# EAGLE design wf121_breakout_v20 (EAGLE 7.5.0)
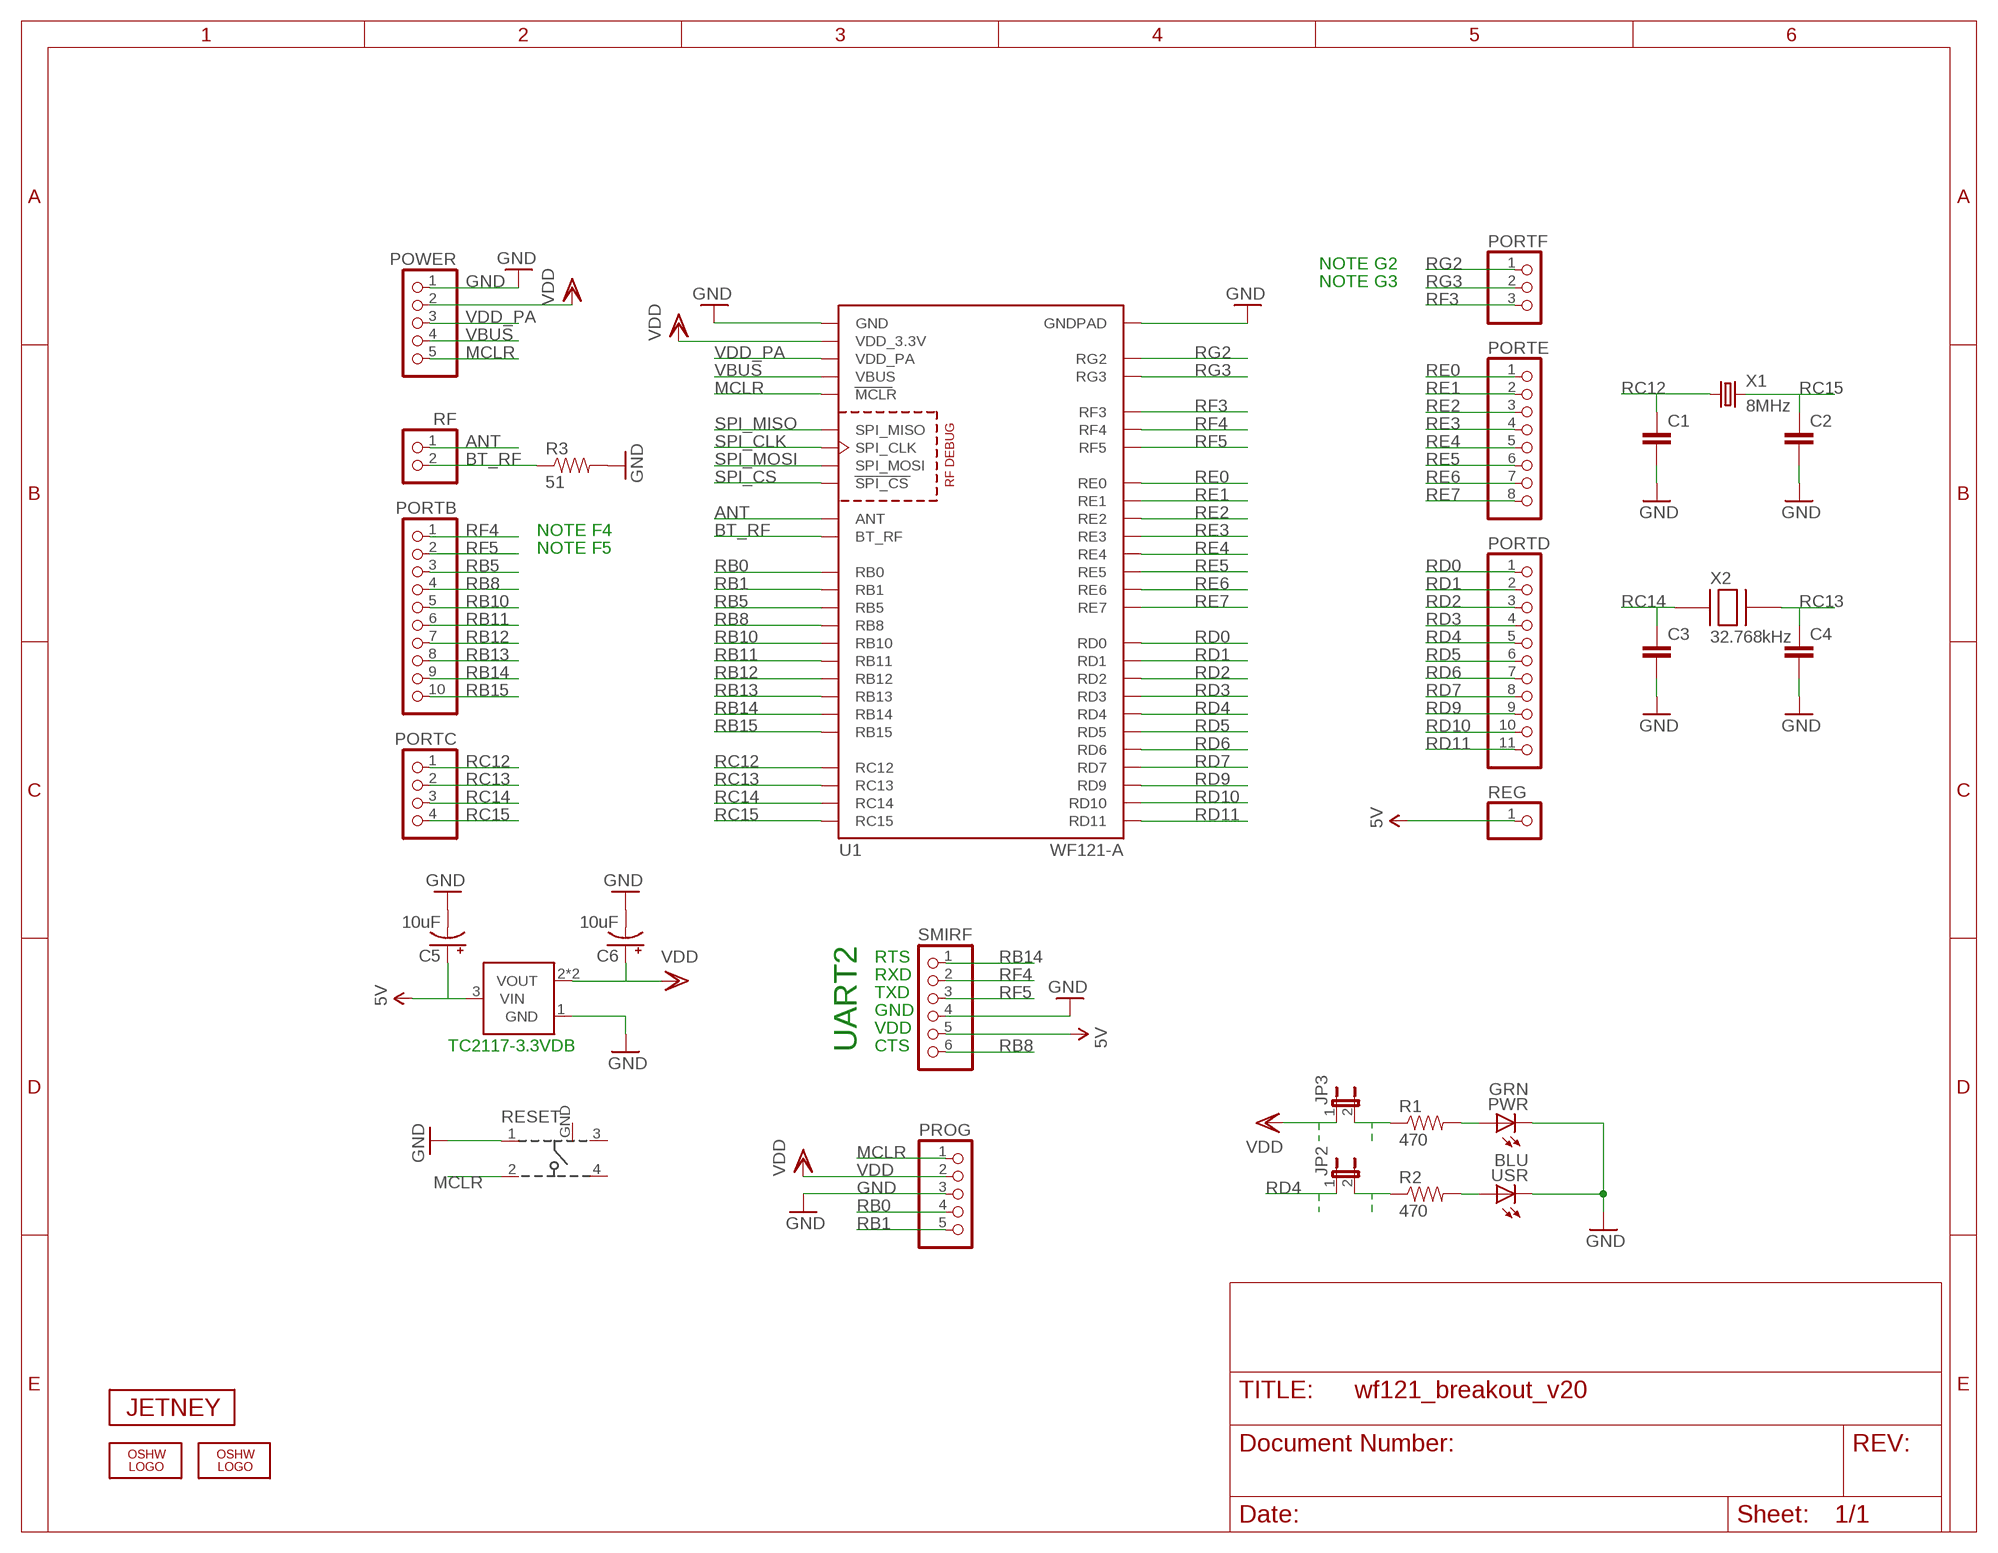
[diagram p0: schematic, sheet 1]

## Parts
C1  CAP0603-CAP  [0603-CAP]
C2  CAP0603-CAP  [0603-CAP]
C3  CAP0603-CAP  [0603-CAP]
C4  CAP0603-CAP  [0603-CAP]
C5  10uF  CAP_POL1206  [EIA3216]
C6  10uF  CAP_POL1206  [EIA3216]
JP2  JUMPER-2SMD-NC  [SJ_2S]
JP3  JUMPER-2SMD-NC  [SJ_2S]
LOGO1  OSHW_LOGO_FILLX0100-NT  [OSHW_FILLX100_NOTEXT]
LOGO2  OSHW_LOGO_FILLX0100-NT  [OSHW_FILLX100_NOTEXT]
PORTB  PINHD-1X10  [1X10]
PORTC  PINHD-1X4  [1X04]
PORTD  PINHD-1X11  [1X11]
PORTE  PINHD-1X8  [1X08]
PORTF  PINHD-1X3  [1X03]
POWER  PINHD-1X5  [1X05]
PROG  PINHD-1X5  [1X05]
PWR  GRN  LEDCHIPLED_0805  [CHIPLED_0805]
R1  470  RESISTOR0603-RES  [0603-RES]
R2  470  RESISTOR0603-RES  [0603-RES]
R3  51  RESISTOR0603-RES  [0603-RES]
REG  PINHD-1X1  [1X01]
RESET  101-IG  [101-IG]
RF  PINHD-1X2  [1X02]
SMIRF  PINHD-1X6  [1X06]
U1  WF121-A  [WF121-A]
U2  VREGAP1117  [SOT223]
U$4  JETNEY-LOGO-12  [JETNEY-LOGO-12]
USR  BLU  LEDCHIPLED_0805  [CHIPLED_0805]
X1  8MHz  CRYSTALTXC-7A  [CRYSTAL-TXC-7A]
X2  32.768kHz  ABS07-120  [ABS07]

## Nets
5V [power]: C5.A(+) REG.1 SMIRF.5 U2.3(VIN)
ANT: RF.1 U1.ANT
BT_RF: R3.1 RF.2 U1.BT_RF
GND [power]: C1.2 C2.2 C3.2 C4.2 C5.C(-) C6.C(-) POWER.1 PROG.3 PWR.C R3.2 RESET.1 SMIRF.4 U1.GND U1.GND@2(GND) U1.GND@3(GND) U1.GND@4(GND) U1.GND@5(GND) U1.GND@6(GND) U1.GNDPAD U2.1(GND) USR.C
MCLR: POWER.5 PROG.1 RESET.2 U1.MCLR
N$1: PWR.A R1.2
N$2: JP2.2 R2.1
N$3: R2.2 USR.A
N$4 [power]: JP3.2 R1.1
RB0: PROG.4 U1.RB0
RB1: PROG.5 U1.RB1
RB5: PORTB.3 U1.RB5
RB8: PORTB.4 SMIRF.6 U1.RB8
RB10: PORTB.5 U1.RB10
RB11: PORTB.6 U1.RB11
RB12: PORTB.7 U1.RB12
RB13: PORTB.8 U1.RB13
RB14: PORTB.9 SMIRF.1 U1.RB14
RB15: PORTB.10 U1.RB15
RC12: C1.1 PORTC.1 U1.RC12 X1.P$1
RC13: C4.1 PORTC.2 U1.RC13 X2.X2
RC14: C3.1 PORTC.3 U1.RC14 X2.X1
RC15: C2.1 PORTC.4 U1.RC15 X1.P$2
RD0: PORTD.1 U1.RD0
RD1: PORTD.2 U1.RD1
RD2: PORTD.3 U1.RD2
RD3: PORTD.4 U1.RD3
RD4: JP2.1 PORTD.5 U1.RD4
RD5: PORTD.6 U1.RD5
RD6: PORTD.7 U1.RD6
RD7: PORTD.8 U1.RD7
RD9: PORTD.9 U1.RD9
RD10: PORTD.10 U1.RD10
RD11: PORTD.11 U1.RD11
RE0: PORTE.1 U1.RE0
RE1: PORTE.2 U1.RE1
RE2: PORTE.3 U1.RE2
RE3: PORTE.4 U1.RE3
RE4: PORTE.5 U1.RE4
RE5: PORTE.6 U1.RE5
RE6: PORTE.7 U1.RE6
RE7: PORTE.8 U1.RE7
RF3: PORTF.3 U1.RF3
RF4: PORTB.1 SMIRF.2 U1.RF4
RF5: PORTB.2 SMIRF.3 U1.RF5
RG2: PORTF.1 U1.RG2
RG3: PORTF.2 U1.RG3
SPI_CLK: U1.SPI_CLK
SPI_CS: U1.SPI_CS
SPI_MISO: U1.SPI_MISO
SPI_MOSI: U1.SPI_MOSI
VBUS: POWER.4 U1.VBUS
VDD [power]: C6.A(+) JP3.1 POWER.2 PROG.2 U1.VDD_3.3V U2.2(VOUT) U2.4(VOUT)
VDD_PA [power]: POWER.3 U1.VDD_PA
Unconnected: RESET.3 RESET.4

## Notes on the sheet
- NOTE G2
- NOTE G3
- NOTE F4
- NOTE F5
- RTS
- RXD
- TXD
- GND
- VDD
- TC2117-3.3VDB | UART2 | CTS

## Power pins joined to a net without a drawn wire
GND: RESET.GND

## Library data of the parts
C1-C4 = SparkFun-Passives:CAP: Capacitor Standard 0603 ceramic capacitor, and 0.1" leaded capacitor.
C5 C6 = SparkFun-Capacitors:CAP_POL: Capacitor Polarized These are standard SMD and PTH capacitors. Normally 10uF, 47uF, and 100uF in electrolytic and tantalum varieties. Always verify the external diameter of the through hole cap, it varies with capacity, voltage, and manufacturer. The EIA devices should be standard.
JP2 JP3 = SparkFun:JUMPER-2: Jumper Basic 0.1" spaced jumper. Use with breakaway headers.
LOGO1 LOGO2 = oshw-logo:OSHW_LOGO_FILL
PORTB = sf-pinhead:PINHD-1X10: PIN HEADER
PORTC = sf-pinhead:PINHD-1X4: PIN HEADER
PORTD = sf-pinhead:PINHD-1X11: PIN HEADER
PORTE = sf-pinhead:PINHD-1X8: PIN HEADER
PORTF = sf-pinhead:PINHD-1X3: PIN HEADER
POWER PROG = sf-pinhead:PINHD-1X5: PIN HEADER
PWR USR = adafruit:LED: LED OSRAM: - CHIPLED LG R971, LG N971, LY N971, LG Q971, LY Q971, LO R971, LY R971 LH N974, LH R974 LS Q976, LO Q976, LY Q976 LO Q996 - Hyper CHIPLED LW Q18S LB Q993, LB Q99A, LB R99A - SideLED LS A670, LO A670, LY A670, LG A670, LP A670 LB A673, LV A673, LT A673, LW A673 LH A674 LY A675 LS A676, LA A676, LO A676, LY A676, LW A676 LS A679, LY A679, LG A679 - Hyper Micro SIDELED® LS Y876, LA Y876, LO Y876, LY Y876 LT Y87S - SmartLED LW L88C, LW L88S LB L89C, LB L89S, LG L890 LS L89K, LO L89K, LY L89K LS L896, LA L896, LO L896, LY L896 - TOPLED LS T670, LO T670, LY T670, LG T670, LP T670 LSG T670, LSP T670, LSY T670, LOP T670, LYG T670 LG T671, LOG T671, LSG T671 LB T673, LV T673, LT T673, LW T673 LH T674 LS T676, LA T676, LO T676, LY T676, LB T676, LH T676, LSB T676, LW T676 LB T67C, LV T67C, LT T67C, LS T67K, LO T67K, LY T67K, LW E67C LS E67B, LA E67B, LO E67B, LY E67B, LB E67C, LV E67C, LT E67C LW T67C LS T679, LY T679, LG T679 LS T770, LO T770, LY T770, LG T770, LP T770 LB T773, LV T773, LT T773, LW T773 LH T774 LS E675, LA E675, LY E675, LS T675 LS T776, LA T776, LO T776, LY T776, LB T776 LHGB T686 LT T68C, LB T68C - Hyper Mini TOPLED® LB M676 - Mini TOPLED Santana® LG M470 LS M47K, LO M47K, LY M47K Source: http://www.osram.convergy.de/
R1-R3 = SparkFun:RESISTOR: Resistor Basic schematic elements and footprints for 0603, 1206, and PTH resistors.
REG = sf-pinhead:PINHD-1X1: PIN HEADER
RESET = sf-keyglove:101-IG
RF = sf-pinhead:PINHD-1X2: PIN HEADER
SMIRF = sf-pinhead:PINHD-1X6: PIN HEADER
U1 = jetney-silabs-modules:WF121: Bluegiga WF121 802.11b/g/n full-stack wi-fi module. WF121-A variant has an on-module ceramic chip antenna, WF121-E variant has a U.Fl connector. WF121-A variant includes keepout/restrict area. Antenna edge of the module should be flush up against the edge of the PCB. See datasheet for variant layout details. Bluegiga's WF121 is a stand-alone Wi-Fi module providing fully integrated 2.4GHz 802.11 b/g/n radio, TCP/IP stack and a 32-bit micro controller (MCU) platform for embedded applications requiring simple, low-cost and low-power wireless IP connectivity. It also provides flexible peripheral interfaces such as SPI, I2C, ADC, GPIO, Bluetooth co-existence, and timers to connect various peripheral interfaces directly to the WF121 Wi-Fi module. The WF121 Wi-Fi module also allows end-user applications to be embedded onto the on-board 32-bit MCU, using a simple Bluegiga BGScript™ scripting language and free-of-charge development tools. This eliminates need for and additional MCU and enables end users to develop smaller and lower cost Wi-Fi devices. The WF121 can also be used in modem-like mode in applications where the external MCU is needed. The 802.11 access point and HTTP server functionality is also included for easy configurations and direct connections with phones, tablets, and PCs. With an integrated 802.11 radio, antenna, single power supply, and CE, FCC, and IC regulatory certifications, the WF121 provides low-risk and fast time-to-market for applications requiring Wi-Fi connectivity. http://www.bluegiga.com/en-US/products/wifi-modules/wf121-wifi-module https://github.com/jrowberg/sf-oshw Last updated 2014-01-04 by Jeff Rowberg <jeff@rowberg.net>; ANTENNA: On-module ceramic chip antenna
U2 = nonolith:VREG
U$4 = sf-keyglove:JETNEY-LOGO
X1 = SparkFun-FreqCtrl:CRYSTAL: Various standard crystals. Proven footprints. Spark Fun Electronics SKU : COM-00534
X2 = sf-keyglove:ABS07-120

## Net classes
0 default: width 0.152 mm, drill 0.33 mm, clearance 0.152 mm
1 power: width 0.254 mm, drill 0.33 mm, clearance 0.152 mm

## Board
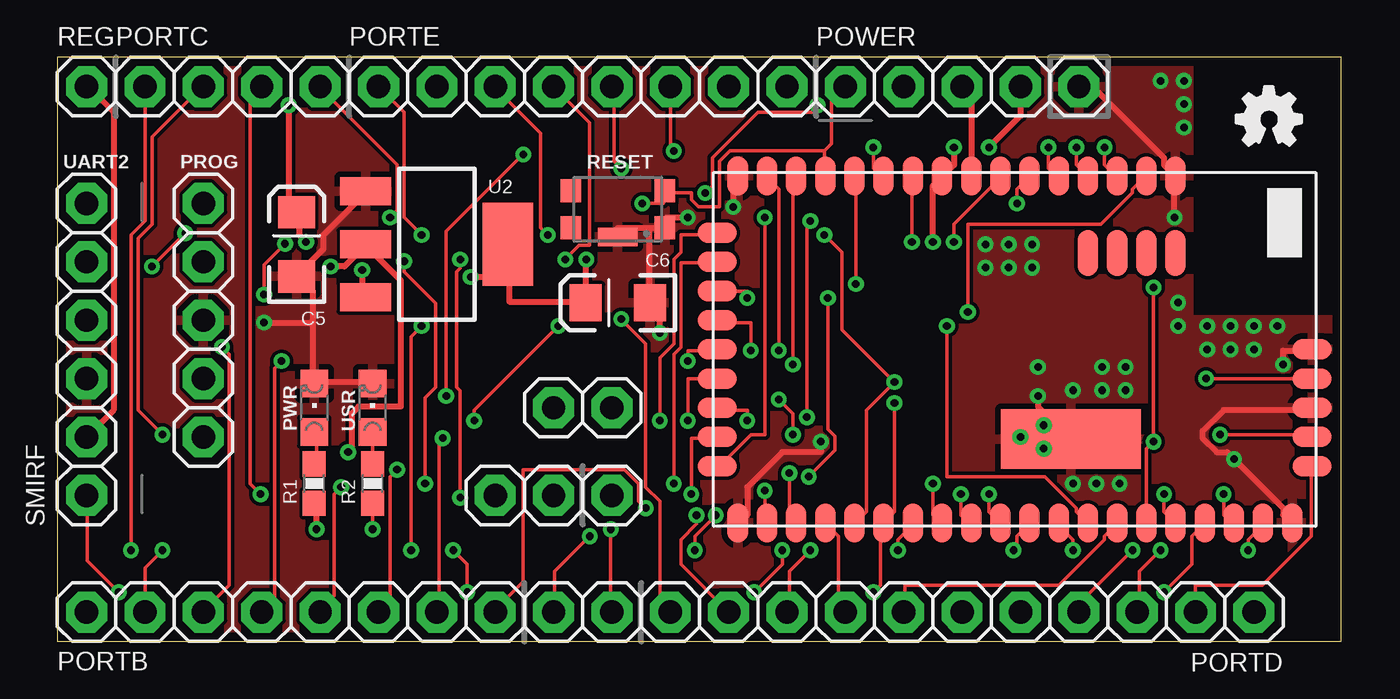
[diagram p1: board, top side]
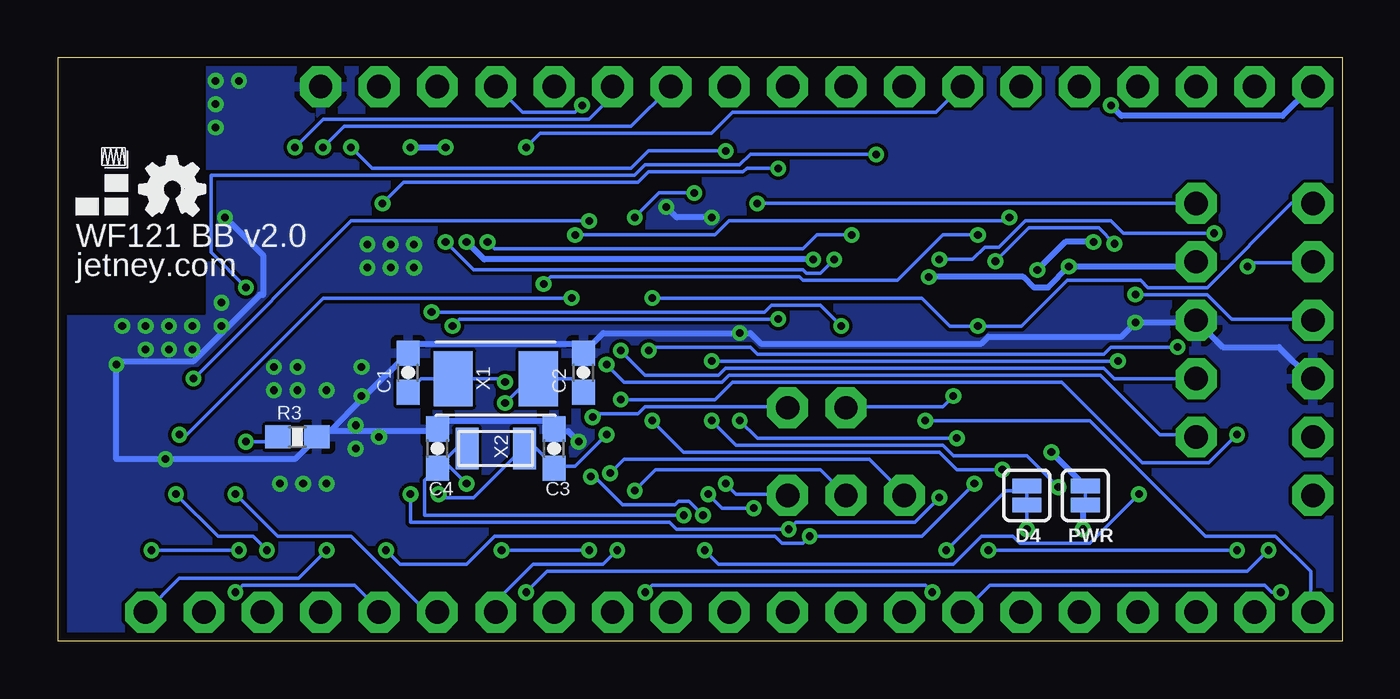
[diagram p2: board, bottom side, seen from below]

Size 55.88 x 25.4 mm. Coordinates in mm from the lower left corner, seen from the top.
Outline: 0,0 55.88,0 55.88,25.4 0,25.4 0,0
Copper layers (1*16): Top 0.0356mm / dielectric 1.5011mm / Bottom 0.0356mm
Design rules "LaenPCBOrder *": minimum track width 6mil, minimum drill 13mil, track to track 6mil, track to pad 6mil, pad to pad 6mil, via to via 6mil, smd to smd 6mil, copper to edge 15mil, drill to drill 6mil, minimum pad ring 7mil, minimum via ring 7mil, stop-mask expansion 4mil, vias tented up to drill 13mil, thermal gap 10mil
tRestrict: area 49.5,14.2 to 55.9,25.4
bRestrict: area 49.5,14.2 to 55.9,25.4
vRestrict: area 0,21.8 to 45.7,22.9; area 0,2.5 to 53.3,3.6; area 2.5,5.1 to 3.6,20.3; area 9.9,9.1 to 10.4,10.7; area 12.4,9.1 to 13,10.7; area 7.6,7.6 to 8.6,20.3; area 18.3,7.9 to 24.6,8.6; area 20.8,11.7 to 25.1,12.4; area 49.5,14.2 to 55.9,25.4

### Footprints (pad centres in the part's own frame; a part is rotated, then mirrored left to right if it is on the bottom)
0603-CAP = smd 1.1 x 1: 1 -0.85,0; 2 0.85,0
EIA3216 = smd 1.4 x 1.6: A 1.4,0; C -1.4,0
SJ_2S = smd 0.635 x 1.27: 1 -0.412,0; 2 0.412,0
1X10 = drill 1.016 pad 1.778 octagon: 1 -11.43,0; 2 -8.89,0; 3 -6.35,0; 4 -3.81,0; 5 -1.27,0; 6 1.27,0; 7 3.81,0; 8 6.35,0; 9 8.89,0; 10 11.43,0
1X04 = drill 1.016 pad 1.778 octagon: 1 -3.81,0; 2 -1.27,0; 3 1.27,0; 4 3.81,0
1X11 = drill 1.016 pad 1.778 octagon: 1 -12.7,0; 2 -10.16,0; 3 -7.62,0; 4 -5.08,0; 5 -2.54,0; 6 0,0; 7 2.54,0; 8 5.08,0; 9 7.62,0; 10 10.16,0; 11 12.7,0
1X08 = drill 1.016 pad 1.778 octagon: 1 -8.89,0; 2 -6.35,0; 3 -3.81,0; 4 -1.27,0; 5 1.27,0; 6 3.81,0; 7 6.35,0; 8 8.89,0
1X03 = drill 1.016 pad 1.778 octagon: 1 -2.54,0; 2 0,0; 3 2.54,0
1X05 = drill 1.016 pad 1.778 octagon: 1 -5.08,0; 2 -2.54,0; 3 0,0; 4 2.54,0; 5 5.08,0
CHIPLED_0805 = smd 1.2 x 1.2: A 0,-1.05; C 0,1.05
0603-RES = smd 1.1 x 1: 1 -0.85,0; 2 0.85,0
1X01 = drill 1.016 pad 1.778 octagon: 1 0,0
101-IG = smd 0.9 x 1: 1 -2.05,0.8; 2 -2.05,-0.8; 3 2.05,0.8; 4 2.05,-0.8 | smd 1.7 x 0.8: GND 0,1.2
1X02 = drill 1.016 pad 1.778 octagon: 1 -1.27,0; 2 1.27,0
1X06 = drill 1.016 pad 1.778 octagon: 1 -6.35,0; 2 -3.81,0; 3 -1.27,0; 4 1.27,0; 5 3.81,0; 6 6.35,0
WF121-A = smd 0.9 x 1.7: ANT 1.27,12.95; GND@5 2.54,12.95; GND@6 0,12.95; RB5 3.81,-12.95; RB8 -5.08,-12.95; RB10 2.54,-12.95; RB11 1.27,-12.95; RB12 0,-12.95; RB13 -1.27,-12.95; RB14 -2.54,-12.95; RD1 3.81,12.95; RD10 5.08,12.95; RF3 -3.81,-12.95; VBUS 5.08,-12.95 | smd 1.7 x 0.9: BT_RF 7.55,5.73; GND -7.55,7; GND@2 -7.55,-12.05; GND@3 7.55,-12.05; GND@4 7.55,12.08; MCLR -7.55,-8.24; RB0 -7.55,-10.78; RB1 -7.55,-9.51; RB15 -7.55,5.73; RC12 7.55,-6.97; RC13 7.55,-3.16; RC14 7.55,-1.89; RC15 7.55,-5.7; RD0 7.55,3.19; RD2 7.55,-4.43; RD3 7.55,-8.24; RD4 7.55,4.46; RD5 7.55,7; RD6 7.55,8.27; RD7 7.55,9.54; RD9 7.55,10.81; RD11 7.55,1.92; RE0 -7.55,4.46; RE1 -7.55,3.19; RE2 -7.55,1.92; RE3 -7.55,0.65; RE4 -7.55,-0.62; RE5 -7.55,-4.43; RE6 -7.55,-5.7; RE7 -7.55,-6.97; RF4 7.55,-0.62; RF5 7.55,0.65; RG2 7.55,-9.51; RG3 7.55,-10.78; VDD_3.3V -7.55,-3.16; VDD_PA -7.55,-1.89 | smd 2.6 x 6.1: GNDPAD 3.9,2.45 | smd 2 x 0.9: SPI_CLK -4.2,5.73; SPI_CS -4.2,3.19; SPI_MISO -4.2,7; SPI_MOSI -4.2,4.46
SOT223 = smd 1.219 x 2.235: 1 -2.311,-3.099; 2 0,-3.099; 3 2.311,-3.099 | smd 3.6 x 2.2: 4 0,3.099
CRYSTAL-TXC-7A = smd 1.7 x 2.4: P$1 1.85,0; P$2 -1.85,0
ABS07 = smd 1 x 1.8: X1 -1.25,0; X2 1.25,0

### Placement (x,y rotation side)
C1  40.64,11.68 90 bottom
C2  33.02,11.68 90 bottom
C3  34.29,8.38 90 bottom
C4  39.37,8.38 90 bottom
C5  10.41,17.27 90 top
C6  24.38,14.73 180 top
JP2  13.72,6.35 270 bottom
JP3  11.18,6.35 270 bottom
LOGO1  51.31,21.59 0 top
LOGO2  52.32,18.54 0 bottom
PORTB  12.7,1.27 180 top
PORTC  7.62,24.13 180 top
PORTD  39.37,1.27 0 top
PORTE  22.86,24.13 180 top
PORTF  21.59,6.35 0 top
POWER  39.37,24.13 180 top
PROG  6.35,13.97 270 top
PWR  11.18,10.16 0 top
R1  11.18,6.86 90 top
R2  13.72,6.86 90 top
R3  45.47,8.89 0 bottom
REG  1.27,24.13 0 top
RESET  24.38,18.8 180 top
RF  22.86,10.16 180 top
SMIRF  1.27,12.7 270 top
U1  41.66,12.7 270 top
U2  16.51,17.27 270 top
U$4  55.12,18.54 0 bottom
USR  13.72,10.16 0 top
X1  36.83,11.43 180 bottom
X2  36.83,8.38 180 bottom

### Tracks (layer width: path | path; a pad name or v marks a point on that pad's centre or on a via)
5V  (via drill 0.33)
  Top 0.254: v10.06,23.32 10.06,19.05 10.36,18.75 C5.A 10.52,18.59 10.52,17.68 v10.82,17.37 | v13.26,16.15 13.26,15.24 13.41,15.09 U2.3 | SMIRF.5 2.44,10.06 2.44,23.01 1.37,24.08 REG.1
  Bottom 0.254: v10.06,23.32 9.6,22.86 2.59,22.86 1.37,24.08 REG.1 | v13.26,16.15 12.04,17.37 v10.82,17.37
ANT  (via drill 0.33)
  Top 0.152: v32.77,18.29 32.61,18.14 v32.61,9.75 | v49.99,11.43 U1.ANT
  Bottom 0.152: v49.99,11.43 43.13,18.29 v32.77,18.29 | v32.61,9.75 32.46,9.91 30.63,9.91 30.33,10.21 24.23,10.21 RF.1
BT_RF  (via drill 0.33)
  Top 0.152: v47.7,15.39 v47.7,8.69 47.4,8.38 47.4,5.18 47.39,5.18 U1.BT_RF | v20.27,21.18 16.92,17.83 v16.92,10.67
  Bottom 0.152: v47.7,8.69 46.48,8.69 46.33,8.84 R3.1 | v47.7,15.39 49.23,16.92 49.23,20.27 30.79,20.27 30.33,20.73 26.21,20.73 25.76,21.18 v20.27,21.18 | v16.92,10.67 17.37,10.21 21.49,10.21 RF.2
GND  (via drill 0.33)
  Top 0.254: 13.41,19.66 U2.1 13.41,19.51 11.58,17.68 11.58,17.07 10.52,16 C5.C 10.52,15.85 11.12,15.24 11.12,13.87 | USR.C 13.72,11.28 11.28,11.28 PWR.C 11.12,11.28 11.12,13.87 | v8.99,13.87 11.12,13.87 | 48.62,20.27 48.16,20.73 48.16,21.03 45.11,24.08 44.5,24.08 POWER.1 | 25.76,17.98 24.38,17.98 RESET.GND | 25.76,17.98 26.36,17.98 RESET.1 26.52,18.14 26.52,18.44 v27.43,18.44 | 25.76,17.98 25.76,14.78 C6.C 25.91,14.63 26.21,14.33 v26.21,13.41 | 29.57,20.12 29.41,19.96 v29.41,18.9 | 53.65,5.18 53.34,5.49 53.34,5.79 v51.21,7.92 50.9,8.23 50.44,8.23 49.84,8.84 49.84,9.14 50.75,10.06 54.56,10.06 | 29.72,5.18 30.02,5.49 30.02,6.71 31.55,8.23 33.22,8.23 v33.22,8.69 | 54.56,12.65 53.34,12.65 v53.34,12.04 | v48.62,18.44 48.62,20.12 | 44.04,8.84 42.67,10.21 v42.67,10.67
  Bottom 0.254: SMIRF.4 1.37,11.43 2.74,12.8 5.18,12.8 PROG.3 6.4,13.87 v8.99,13.87 9.6,13.26 15.39,13.26 15.7,12.95 25.3,12.95 25.76,13.41 v26.21,13.41 32.16,13.41 32.92,12.65 C2.2 33.07,12.65 33.38,12.95 40.23,12.95 40.54,12.65 C1.2 40.69,12.5 42.6,10.59 | v29.41,18.9 28.96,18.44 v27.43,18.44 | 44.04,9.14 39.47,9.14 C4.2 39.32,9.3 39.01,9.6 34.59,9.6 34.29,9.3 C3.2 34.29,9.14 33.68,9.14 v33.22,8.69 | 44.04,9.14 44.35,9.14 44.5,8.99 R3.2 44.65,8.84 45.57,7.92 v51.21,7.92 53.34,7.92 v53.34,12.04 53.19,12.19 49.99,12.19 47.09,15.09 46.94,15.09 46.94,16.76 v48.62,18.44 | 44.04,9.14 42.6,10.59 | v42.67,10.67 42.6,10.59
  other vias: 41.91,8.89 42.93,9.4 42.93,8.38 40.39,17.27 41.4,17.27 42.42,17.27 40.39,16.26 41.4,16.26 42.42,16.26 45.47,10.92 46.48,10.92 44.2,10.92 42.67,11.94 45.47,11.94 46.48,11.94 44.2,6.86 45.21,6.86 46.23,6.86 50.04,13.72 51.05,13.72 52.07,13.72 53.09,13.72 48.77,13.72 48.77,14.73 50.04,12.7 51.05,12.7 52.07,12.7 49.02,22.35 49.02,23.37 49.02,24.38 48.01,24.38
  pour Bottom: 0,25.4 55.88,25.4 55.88,0 0,0
  pour Top: 0,25.4 55.88,25.4 55.88,0 0,0
MCLR  (via drill 0.33)
  Top 0.152: 33.38,21.34 29.26,21.34 28.8,20.88 28.8,18.9 27.89,18.9 27.58,19.2 27.58,19.51 26.52,19.51 RESET.2 26.36,19.51 26.36,19.05 v25.45,19.05 | 33.38,21.34 33.38,20.27 33.42,20.27 U1.MCLR | 33.38,21.34 33.68,21.64 33.68,23.47 34.29,24.08 POWER.5
  Bottom 0.152: v25.45,19.05 PROG.1
N$1
  Top 0.152: R1.2 11.28,7.77 11.28,8.99 PWR.A
N$2  (via drill 0.33)
  Top 0.152: v13.72,4.88 R2.1
  Bottom 0.152: JP2.2 v13.72,4.88
N$3
  Top 0.152: USR.A R2.2
N$4  (via drill 0.33)
  Top 0.254: v11.28,4.88 11.28,5.94 R1.1
  Bottom 0.254: v11.28,4.88 11.28,5.79 JP3.2
N$5
  Bottom 0.152: 11.18,6.6 11.18,6.1
N$6
  Bottom 0.152: 13.72,6.1 13.72,6.6
RB0  (via drill 0.33)
  Top 0.152: 30.99,20.07 31.39,19.66 v31.39,12.65 | 30.99,20.07 30.94,20.12 | U1.RB0 30.99,20.25 30.99,20.07
  Bottom 0.152: v31.39,12.65 30.33,11.58 27.13,11.58 26.82,11.89 10.36,11.89 9.91,11.43 PROG.4
RB1  (via drill 0.33)
  Top 0.152: v32,12.04 32,20.12 32.15,20.12 U1.RB1
  Bottom 0.152: v32,12.04 31.24,11.28 26.98,11.28 26.67,11.58 10.52,11.58 7.92,8.99 6.4,8.99 PROG.5
RB5  (via drill 0.33)
  Top 0.152: v27.58,6.4 27.58,8.84 28.71,8.84 U1.RB5 | v25.6,5.79 25.3,6.1 25.3,6.86 24.69,7.47 20.27,7.47 20.27,2.59 19.05,1.37 PORTB.3
  Bottom 0.152: v27.58,6.4 26.98,5.79 v25.6,5.79
RB8  (via drill 0.33)
  Top 0.152: v26.21,9.6 26.21,12.34 26.82,12.95 26.82,16.61 27.13,16.92 27.13,17.68 28.71,17.68 U1.RB8 | v16.76,8.84 16.61,8.69 16.61,1.37 PORTB.4 | v2.67,2.13 1.29,3.5 1.29,6.33 SMIRF.6
  Bottom 0.152: v26.21,9.6 25.45,8.84 v16.76,8.84 | v2.67,2.13 3.05,2.13 3.35,2.44 15.32,2.44 16.46,1.29 PORTB.4
RB10  (via drill 0.33)
  Top 0.152: v30.02,9.6 30.02,10.06 28.8,10.06 28.8,10.16 U1.RB10 | v14.78,7.47 14.48,7.16 14.48,1.83 14.02,1.37 PORTB.5
  Bottom 0.152: v30.02,9.6 28.65,8.23 17.53,8.23 16.76,7.47 v14.78,7.47
RB11  (via drill 0.33)
  Top 0.152: v27.43,9.6 27.43,11.43 U1.RB11 | v12.34,6.71 12.04,6.4 12.04,1.98 11.43,1.37 PORTB.6
  Bottom 0.152: v27.43,9.6 26.36,8.53 17.37,8.53 16.92,8.08 13.72,8.08 v12.34,6.71
RB12  (via drill 0.33)
  Top 0.152: v27.43,12.19 27.43,12.65 28.71,12.65 U1.RB12 | v9.75,12.19 9.45,11.89 9.45,1.83 PORTB.7
  Bottom 0.152: v9.75,12.19 v27.43,12.19
RB13  (via drill 0.33)
  Top 0.152: v30.18,12.65 30.18,13.87 28.71,13.87 U1.RB13 | v7.16,12.8 7.47,12.5 7.47,2.44 6.4,1.37 PORTB.8
  Bottom 0.152: v30.18,12.65 30.02,12.8 25.76,12.8 25.45,12.5 10.36,12.5 10.06,12.8 v7.16,12.8
RB14  (via drill 0.33)
  Top 0.152: v15.85,13.72 15.39,13.26 v15.39,3.96 | v4.57,3.96 3.81,3.2 PORTB.9 | U1.RB14 30.02,15.24 v30.02,14.94
  Bottom 0.152: v30.02,14.94 18.29,14.94 17.07,13.72 v15.85,13.72 13.95,13.72 11.96,15.7 8.76,15.7 8.46,15.39 5.87,15.39 2.21,19.05 SMIRF.1 | v4.57,3.96 v15.39,3.96
RB15  (via drill 0.33)
  Top 0.152: v39.62,14.33 39.62,18.14 45.41,18.14 46.79,19.51 46.79,19.66 47.24,20.12 47.39,20.12 U1.RB15 | v21.79,13.72 18.14,10.06 v18.14,9.6
  Bottom 0.152: v39.62,14.33 25.15,14.33 24.84,14.63 22.71,14.63 v21.79,13.72 | v18.14,9.6 10.97,9.6 5.94,4.57 2.9,4.57 1.37,3.05 1.37,1.37 PORTB.10
RC12  (via drill 0.33)
  Top 0.152: v14.48,18.44 14.78,18.75 14.78,20.73 11.43,24.08 PORTC.1 | v33.38,17.68 34.14,16.92 34.14,13.56 v36.42,11.28 35.2,10.06 35.2,5.64 34.75,5.18 34.75,5.15 U1.RC12
  Bottom 0.152: C1.1 40.54,10.97 40.08,11.43 X1.P$1 36.58,11.43 v36.42,11.28 | v14.48,18.44 14.63,18.29 26.67,18.29 27.28,17.68 v33.38,17.68
RC13  (via drill 0.33)
  Top 0.152: v38.1,6.86 38.1,5.49 38.41,5.18 38.41,5.15 U1.RC13 | v28.65,5.49 27.74,4.57 v27.74,3.96 | v8.84,6.4 8.38,6.86 8.38,23.62 PORTC.2
  Bottom 0.152: 39.17,7.77 38.56,8.38 X2.X2 | 39.17,7.77 39.32,7.62 C4.1 | v38.1,6.86 39.01,7.77 39.17,7.77 | 39.17,7.77 C4.1 | v28.65,5.49 39.93,5.49 39.93,7.01 39.47,7.47 C4.1 | v27.74,3.96 27.13,3.35 16.92,3.35 15.7,4.57 14.33,4.57 14.02,4.27 10.97,4.27 v8.84,6.4
RC14  (via drill 0.33)
  Top 0.152: v39.32,6.4 39.32,5.49 39.62,5.18 39.62,5.15 U1.RC14 | v4.57,8.99 3.5,10.06 3.5,17.53 4.12,18.14 4.12,21.95 6.25,24.08 PORTC.3 | v31.39,10.52 32,9.91 v32,8.99
  Bottom 0.152: 34.29,7.62 35.05,8.38 X2.X1 35.66,8.38 37.8,6.25 39.17,6.25 v39.32,6.4 | v4.57,8.99 5.79,7.77 8.69,7.77 12.19,11.28 26.52,11.28 27.28,10.52 v31.39,10.52 | v32,8.99 33.38,7.62 34.29,7.62 | 34.29,7.62 C3.1
RC15  (via drill 0.33)
  Top 0.152: v36.42,10.36 36.42,5.64 35.97,5.18 U1.RC15 35.96,5.03 35.81,5.03 35.81,2.44 v35.51,2.13 | PORTC.4 3.81,18.29 3.2,17.68 v3.2,3.96
  Bottom 0.152: C2.1 33.07,10.97 33.53,11.43 X1.P$2 35.36,11.43 v36.42,10.36 | v3.2,3.96 4.12,3.05 34.59,3.05 v35.51,2.13
RD0  (via drill 0.33)
  Top 0.152: v38.71,13.72 38.71,7.16 42.98,7.16 44.35,5.79 44.35,5.64 44.81,5.18 44.81,5.15 U1.RD0 | v24.54,14.02 25.6,12.95 25.6,6.71 26.21,6.1 26.21,1.83 26.67,1.37 PORTD.1
  Bottom 0.152: v38.71,13.72 38.41,14.02 v24.54,14.02
RD1  (via drill 0.33)
  Top 0.152: v50.6,8.99 54.61,8.99 U1.RD1 | v33.53,14.94 33.53,9.22 33.83,8.91 33.83,8.31 v32.69,7.16 | v27.81,5.49 27.81,5.11 27.13,4.42 27.13,3.35 PORTD.2
  Bottom 0.152: v50.6,8.99 50.29,8.99 44.35,14.94 v33.53,14.94 | v32.69,7.16 32.54,7.16 31.32,5.94 29.03,5.94 28.88,6.1 28.42,6.1 v27.81,5.49
RD2  (via drill 0.33)
  Top 0.152: v36.58,3.96 36.58,4.42 37.19,5.03 37.23,5.03 U1.RD2 | v32.77,3.96 31.85,3.05 31.85,1.37 PORTD.3
  Bottom 0.152: v32.77,3.96 v36.58,3.96
RD3
  Top 0.152: PORTD.4 34.29,1.37 33.98,1.68 33.98,4.57 33.53,5.03 33.53,5.15 U1.RD3
  Bottom 0.152: 34.29,1.37 PORTD.4
RD4  (via drill 0.33)
  Top 0.152: v17.22,3.96 17.83,3.35 v17.83,2.13 | v30.33,2.13 31.55,3.35 v31.55,3.96 | PORTD.5 36.88,1.37 36.88,2.44 43.59,2.44 45.57,4.42 45.57,4.57 46.02,5.03 46.02,5.15 U1.RD4
  Bottom 0.152: v17.22,3.96 14.63,6.55 13.87,6.55 13.72,6.71 JP2.1 | v17.83,2.13 18.14,2.44 30.02,2.44 v30.33,2.13 | v31.55,3.96 32.16,3.35 35.2,3.35 36.73,1.83 36.73,1.37 PORTD.5
RD5  (via drill 0.33)
  Top 0.152: v48.16,6.4 48.16,5.64 48.62,5.18 48.66,5.18 U1.RD5
  Bottom 0.152: v48.16,6.4 46.33,4.57 43.13,4.57 39.93,1.37 39.47,1.37 PORTD.6
RD6  (via drill 0.33)
  Top 0.152: v48.16,2.13 49.38,3.35 49.38,4.57 49.84,5.03 49.84,5.15 U1.RD6
  Bottom 0.152: v48.16,2.13 47.85,2.44 42.98,2.44 41.91,1.37 PORTD.7
RD7  (via drill 0.33)
  Top 0.152: v50.75,6.4 50.75,5.49 51.05,5.18 51.05,5.15 U1.RD7 | v46.79,3.96 44.5,1.68 44.5,1.37 PORTD.8
  Bottom 0.152: v50.75,6.4 48.92,4.57 47.4,4.57 v46.79,3.96
RD9  (via drill 0.33)
  Top 0.152: 52.27,4.88 51.82,4.42 v51.82,3.96 | 52.27,4.88 52.43,5.03 | v48.01,3.96 47.09,3.05 47.09,1.37 PORTD.9 | U1.RD9 52.27,5.15 52.27,4.88
  Bottom 0.152: v48.01,3.96 v51.82,3.96
RD10
  Top 0.152: PORTD.10 49.53,2.44 52.43,2.44 54.56,4.57 54.56,7.62 U1.RD10
RD11  (via drill 0.33)
  Top 0.152: v44.2,3.96 44.2,4.42 43.59,5.03 U1.RD11
  Bottom 0.152: v44.2,3.96 45.41,2.74 50.6,2.74 PORTD.11
RE0  (via drill 0.33)
  Top 0.152: v45.57,21.49 45.57,20.73 46.02,20.27 46.12,20.27 U1.RE0
  Bottom 0.152: v45.57,21.49 44.35,22.71 32.77,22.71 31.85,23.62 31.85,24.08 PORTE.1
RE1  (via drill 0.33)
  Top 0.152: v44.35,21.49 44.35,20.73 44.81,20.27 44.81,20.25 U1.RE1
  Bottom 0.152: v44.35,21.49 43.43,22.4 30.94,22.4 PORTE.2
RE2  (via drill 0.33)
  Top 0.152: v43.13,21.49 43.13,20.57 43.43,20.27 43.58,20.27 U1.RE2 | v26.82,21.34 26.67,21.49 PORTE.3
  Bottom 0.152: v43.13,21.49 42.22,20.57 30.94,20.57 30.18,21.34 v26.82,21.34
RE3  (via drill 0.33)
  Top 0.152: 42.16,20.07 41.76,19.66 v41.76,19.05 | 42.16,20.07 42.22,20.12 | v24.54,20.57 24.23,20.88 24.23,24.08 PORTE.4 | U1.RE3 42.16,20.25 42.16,20.07
  Bottom 0.152: v41.76,19.05 40.84,19.96 30.63,19.96 30.18,20.42 26.06,20.42 25.91,20.57 v24.54,20.57
RE4  (via drill 0.33)
  Top 0.152: v39.01,17.37 39.01,18.14 41,20.12 41.04,20.12 U1.RE4 | v22.1,16.61 22.71,17.22 23.16,17.22 23.16,22.55 PORTE.5
  Bottom 0.152: v39.01,17.37 37.8,16.15 23.47,16.15 23.32,16 22.71,16 v22.1,16.61
RE5  (via drill 0.33)
  Top 0.152: v37.19,17.37 37.19,20.25 U1.RE5 | v21.34,17.68 21.03,17.98 21.03,22.1 19.05,24.08 PORTE.6
  Bottom 0.152: v37.19,17.37 36.88,17.07 23.47,17.07 22.86,17.68 v21.34,17.68
RE6  (via drill 0.33)
  Top 0.152: v35.51,21.49 35.51,20.57 35.81,20.27 35.81,20.25 U1.RE6
  Bottom 0.152: v35.51,21.49 34.9,22.1 27.43,22.1 26.52,23.01 17.68,23.01 16.61,24.08 PORTE.7
RE7  (via drill 0.33)
  Top 0.152: v34.75,15.54 34.75,20.12 34.69,20.12 U1.RE7 | v15.85,17.68 15.09,18.44 15.09,23.01 PORTE.8
  Bottom 0.152: v34.75,15.54 34.44,15.85 23.62,15.85 23.47,15.7 19.36,15.7 17.37,17.68 v15.85,17.68
RF3  (via drill 0.33)
  Top 0.152: v26.82,6.86 26.82,12.5 27.13,12.8 27.13,16.46 28.71,16.46 U1.RF3
  Bottom 0.152: v26.82,6.86 26.36,6.4 24.23,6.4 PORTF.3
RF4  (via drill 0.33)
  Top 0.152: v40.54,6.4 40.54,5.64 41,5.18 41.04,5.18 U1.RF4 | v24.08,4.88 24.08,1.37 PORTB.1 | v5.56,17.75 v4.12,16.31 | v17.53,16.61 17.53,16.23 17.37,16.08 17.37,11.05 17.53,10.9 v17.53,6.25
  Bottom 0.152: v40.54,6.4 40.54,5.18 29.26,5.18 28.96,4.88 v24.08,4.88 23.77,5.18 18.59,5.18 v17.53,6.25 | v4.12,16.31 3.96,16.46 1.29,16.46 SMIRF.2 | v5.56,17.75 9.53,17.75 10.06,18.29 13.79,18.29 14.94,17.14 15.54,17.14 16.08,16.61 v17.53,16.61
RF5  (via drill 0.33)
  Top 0.152: v41.6,3.96 41.76,4.12 41.76,4.57 42.22,5.03 42.31,5.03 U1.RF5 | v23.16,4.57 21.64,3.05 21.64,1.37 PORTB.2 | v8.99,15.09 8.99,16.38 v9.91,17.3 | v15.09,16.54 15.09,16.08 16.46,14.71 16.46,11.05 16,10.59 v16,6.86
  Bottom 0.152: v41.6,3.96 41,3.35 38.1,3.35 36.88,4.57 24.69,4.57 24.38,4.27 23.47,4.27 v23.16,4.57 18.29,4.57 v16,6.86 | v8.99,15.09 5.87,15.09 4.8,14.02 1.29,14.02 SMIRF.3 | v9.91,17.3 10.59,17.98 13.64,17.98 v15.09,16.54
RG2  (via drill 0.33)
  Top 0.152: v31.85,7.32 31.85,5.33 32,5.18 32,5.15 U1.RG2
  Bottom 0.152: v31.85,7.32 31.24,7.92 20.57,7.92 19.05,6.4 PORTF.1
RG3  (via drill 0.33)
  Top 0.152: v30.79,6.55 30.79,5.15 U1.RG3
  Bottom 0.152: v30.79,6.55 29.87,7.47 22.71,7.47 PORTF.2
VBUS  (via drill 0.33)
  Top 0.152: v30.79,18.44 30.79,8.99 30.18,8.99 28.8,7.62 U1.VBUS | v28.19,19.51 28.5,19.81 28.5,21.03 30.48,23.01 33.07,23.01 v33.07,23.32
  Bottom 0.152: v30.79,18.44 29.72,19.51 v28.19,19.51 | v33.07,23.32 33.38,23.01 35.66,23.01 36.73,24.08 POWER.4
VDD  (via drill 0.33)
  Top 0.254: 38.61,20.32 39.01,20.73 v39.01,21.49 | 38.61,20.32 38.56,20.27 | v40.54,21.49 41.91,22.86 POWER.2 | 19.66,15.85 19.66,17.22 U2.4 19.66,15.85 | 19.66,15.85 19.66,14.78 22.86,14.78 C6.A 23.01,14.78 v23.01,16.61 | v12.65,8.23 12.8,8.38 12.8,9.91 13.11,10.21 14.94,10.21 14.94,15.7 13.41,17.22 | v11.89,16.31 12.5,16.31 13.41,17.22 | 13.41,17.22 U2.2 | v17.98,15.85 19.66,15.85 | v38.1,17.37 38.1,19.81 38.41,20.12 38.5,20.12 U1.VDD_3.3V 38.61,20.25 38.61,20.32
  Bottom 0.254: v40.54,21.49 v39.01,21.49 | v12.65,8.23 11.28,6.86 JP3.1 | PROG.2 6.55,16.31 v11.89,16.31 12.8,15.39 13.41,15.39 13.87,15.85 v17.98,15.85 | v38.1,17.37 37.34,16.61 v23.01,16.61
VDD_PA
  Top 0.254: POWER.3 39.47,24.08 39.78,23.77 39.78,20.27 39.77,20.27 U1.VDD_PA

### Text on the board
tPlace: UART2 | PROG
bPlace: WF121 BB v2.0 | jetney.com | PWR | D4
tDocu: 5V | C15 C14 C13 C12 | E7 E6 E5 E4 E3 E2 E1 E0 | MCLR | VBUS | VPA 3V3 GND | RTS RXD TXD GND VCC CTS | MCLR | 3V3 GND RB0 RB1 | BT | ANT | Bluegiga / WF121-A | G2 G3 F3 | B15 B14 B13 B12 B11 B10 | B8 B5 F5 F4 D0 D1 D2 D3 D4 D5 D6 D7 D9 | D10 D11
bDocu: 51 NO COEX